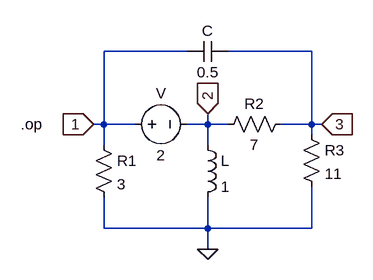
[diagram p0: schematic RLC_network_1.asc]
RLC_network_1.asc, the LTspice schematic file:
Version 4
SHEET 1 880 680
WIRE 96 -16 -32 -16
WIRE 288 -16 160 -16
WIRE -32 96 -32 -16
WIRE -32 96 -48 96
WIRE 16 96 -32 96
WIRE 128 96 128 80
WIRE 128 96 96 96
WIRE 160 96 128 96
WIRE 288 96 288 -16
WIRE 288 96 240 96
WIRE 304 96 288 96
WIRE 288 112 288 96
WIRE -32 128 -32 96
WIRE 128 128 128 96
WIRE -32 256 -32 208
WIRE 128 256 128 208
WIRE 128 256 -32 256
WIRE 288 256 288 192
WIRE 288 256 128 256
WIRE 128 288 128 256
FLAG 128 288 0
FLAG -48 96 1
IOPIN -48 96 In
FLAG 128 80 2
IOPIN 128 80 In
FLAG 304 96 3
IOPIN 304 96 In
SYMBOL res -48 112 R0
SYMATTR InstName R1
SYMATTR Value 3
SYMBOL res 256 80 R90
WINDOW 0 0 56 VBottom 2
WINDOW 3 32 56 VTop 2
SYMATTR InstName R2
SYMATTR Value 7
SYMBOL res 272 96 R0
SYMATTR InstName R3
SYMATTR Value 11
SYMBOL cap 160 -32 R90
WINDOW 0 0 32 VBottom 2
WINDOW 3 32 32 VTop 2
SYMATTR InstName C
SYMATTR Value 0.5
SYMBOL ind 112 112 R0
SYMATTR InstName L
SYMATTR Value 1
SYMATTR SpiceLine Rser=0
SYMBOL voltage 0 96 R270
WINDOW 0 32 56 VTop 2
WINDOW 3 -32 56 VBottom 2
WINDOW 123 0 0 Left 0
WINDOW 39 0 0 Left 0
SYMATTR InstName V
SYMATTR Value 2
TEXT -160 96 Left 2 !.op

The netlist it stands for:
* RLC_network_1.asc
R1 1 0 3
R2 3 2 7
R3 3 0 11
C 3 1 0.5
L 2 0 1 Rser=0
V 1 2 2
.op
.backanno
.end